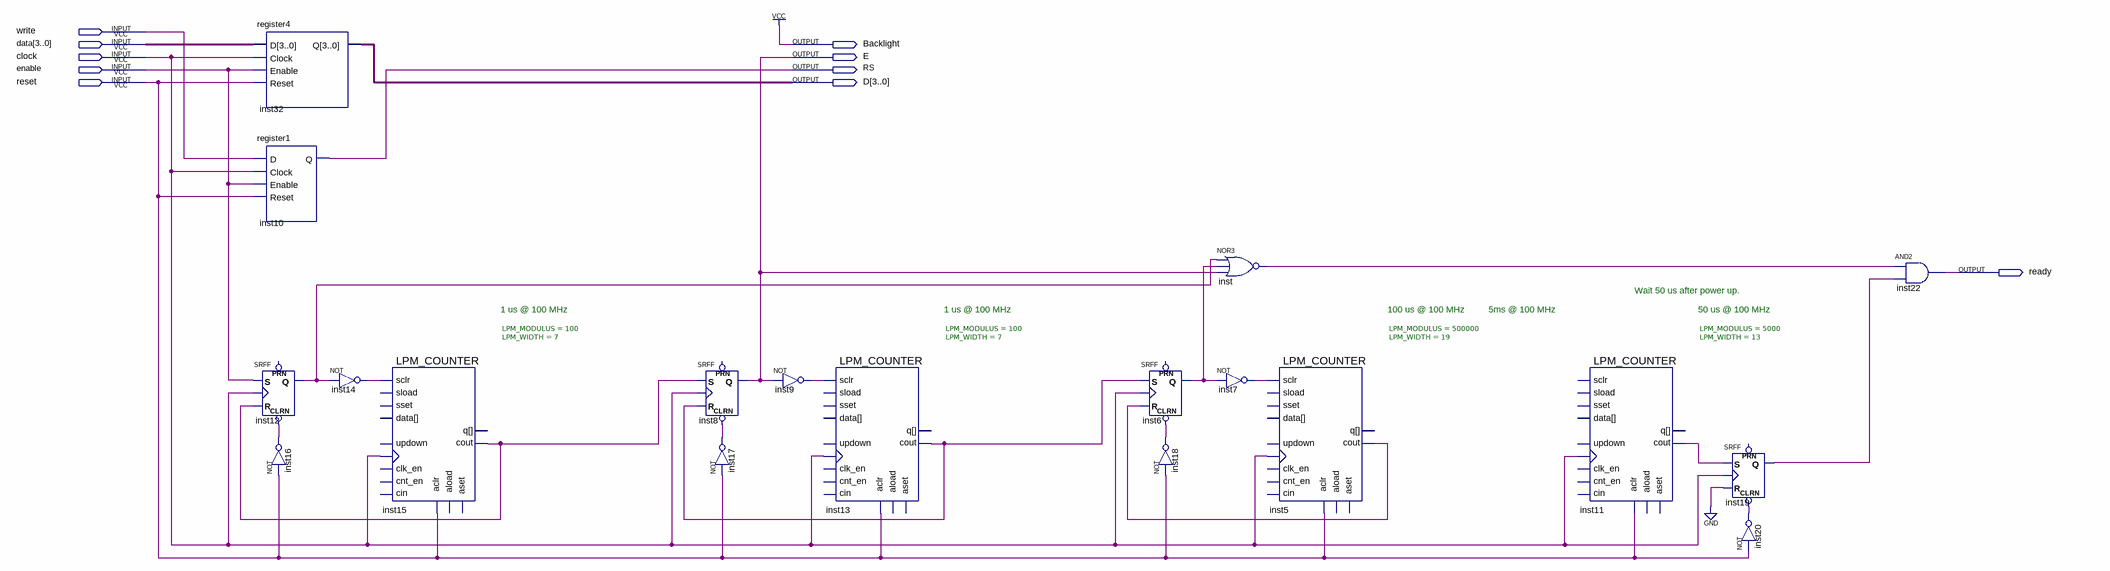
[diagram p0: schematic sheet]
// Quartus schematic lcd_write4.bdf as structural Verilog: 19 symbols, 10 pins
module lcd_write4 (
  input  write,
  input  [3:0] data,
  input  clock,
  input  enable,
  input  reset,
  output Backlight,
  output E,
  output RS,
  output [3:0] D,
  output ready
);

  wire inst5_cout, inst6_q, inst7_out, inst9_out, inst11_cout, inst12_q, inst13_cout, inst14_out,
       inst15_cout, inst16_out, inst17_out, inst18_out, inst19_q, inst20_out, inst_out;

  register4 inst32 (.D(data), .Clock(clock), .Enable(enable), .Reset(reset), .Q(D));
  register1 inst10 (.D(write), .Clock(clock), .Enable(enable), .Reset(reset), .Q(RS));
  SRFF inst12 (.CLRN(inst16_out), .S(enable), .R(inst15_cout), .CLK(clock), .Q(inst12_q));  // open: PRN
  not inst16 (inst16_out, reset);
  not inst14 (inst14_out, inst12_q);
  LPM_COUNTER #(.LPM_MODULUS(100), .LPM_WIDTH(7)) inst15 (
    .aclr(reset), .clock(clock), .sclr(inst14_out), .cout(inst15_cout));  // open: aload, aset, cin, clk_en, cnt_en, data, sload, sset, updown, q
  SRFF inst8 (.CLRN(inst17_out), .S(inst15_cout), .R(inst13_cout), .CLK(clock), .Q(E));  // open: PRN
  not inst17 (inst17_out, reset);
  not inst9 (inst9_out, E);
  LPM_COUNTER #(.LPM_MODULUS(100), .LPM_WIDTH(7)) inst13 (
    .aclr(reset), .clock(clock), .sclr(inst9_out), .cout(inst13_cout));  // open: aload, aset, cin, clk_en, cnt_en, data, sload, sset, updown, q
  SRFF inst6 (.CLRN(inst18_out), .S(inst13_cout), .R(inst5_cout), .CLK(clock), .Q(inst6_q));  // open: PRN
  not inst18 (inst18_out, reset);
  nor inst (inst_out, inst12_q, inst6_q, E);
  not inst7 (inst7_out, inst6_q);
  LPM_COUNTER #(.LPM_MODULUS(500000), .LPM_WIDTH(19)) inst5 (
    .aclr(reset), .clock(clock), .sclr(inst7_out), .cout(inst5_cout));  // open: aload, aset, cin, clk_en, cnt_en, data, sload, sset, updown, q
  LPM_COUNTER #(.LPM_MODULUS(5000), .LPM_WIDTH(13)) inst11 (
    .aclr(reset), .clock(clock), .cout(inst11_cout));  // open: aload, aset, cin, clk_en, cnt_en, data, sclr, sload, sset, updown, q
  SRFF inst19 (.CLRN(inst20_out), .S(inst11_cout), .R(1'b0), .CLK(clock), .Q(inst19_q));  // open: PRN
  not inst20 (inst20_out, reset);
  and inst22 (ready, inst_out, inst19_q);

  assign Backlight = 1'b1;

  // Notes on the sheet:
  //   Wait 50 us after power up.
  //   1 us @ 100 MHz
  //   1 us @ 100 MHz
  //   100 us @ 100 MHz
  //   5ms @ 100 MHz
  //   50 us @ 100 MHz
endmodule
